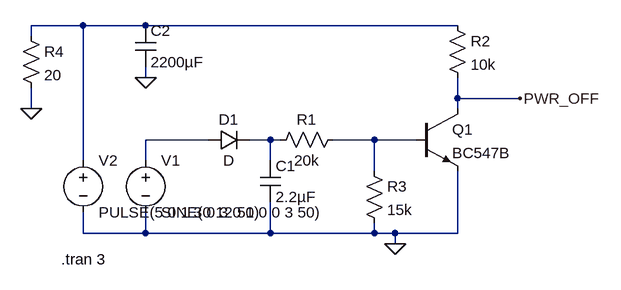
[diagram p0: schematic power-detect-simulation.asc]
power-detect-simulation.asc, the LTspice schematic file:
Version 4
SHEET 1 880 680
WIRE -160 -112 -240 -112
WIRE -64 -112 -160 -112
WIRE 416 -112 -64 -112
WIRE -240 -96 -240 -112
WIRE -64 -32 -64 -48
WIRE 416 0 416 -32
WIRE 512 0 416 0
WIRE -240 16 -240 -16
WIRE 416 16 416 0
WIRE 32 64 -64 64
WIRE 128 64 96 64
WIRE 144 64 128 64
WIRE 288 64 224 64
WIRE 352 64 288 64
WIRE -160 96 -160 -112
WIRE -64 96 -64 64
WIRE 128 96 128 64
WIRE 288 112 288 64
WIRE -160 208 -160 176
WIRE -64 208 -64 176
WIRE -64 208 -160 208
WIRE 128 208 128 160
WIRE 128 208 -64 208
WIRE 288 208 288 192
WIRE 288 208 128 208
WIRE 320 208 288 208
WIRE 416 208 416 112
WIRE 416 208 320 208
WIRE 320 224 320 208
FLAG 320 224 0
FLAG 512 0 PWR_OFF
FLAG -64 -32 0
FLAG -240 16 0
SYMBOL voltage -64 80 R0
WINDOW 123 0 0 Left 0
WINDOW 39 0 0 Left 0
SYMATTR InstName V1
SYMATTR Value SINE(0 12 50 0 0 3 50)
SYMBOL diode 32 80 R270
WINDOW 0 32 32 VTop 2
WINDOW 3 0 32 VBottom 2
SYMATTR InstName D1
SYMBOL res 240 48 R90
WINDOW 0 0 56 VBottom 2
WINDOW 3 32 56 VTop 2
SYMATTR InstName R1
SYMATTR Value 20k
SYMBOL cap 112 96 R0
SYMATTR InstName C1
SYMATTR Value 2.2µF
SYMBOL npn 352 16 R0
SYMATTR InstName Q1
SYMATTR Value BC547B
SYMBOL res 400 -128 R0
SYMATTR InstName R2
SYMATTR Value 10k
SYMBOL voltage -160 80 R0
WINDOW 123 0 0 Left 0
WINDOW 39 0 0 Left 0
SYMATTR InstName V2
SYMATTR Value PULSE(5 0 1 3 0 3 0 1)
SYMBOL res 272 96 R0
SYMATTR InstName R3
SYMATTR Value 15k
SYMBOL cap -80 -112 R0
SYMATTR InstName C2
SYMATTR Value 2200µF
SYMBOL res -256 -112 R0
SYMATTR InstName R4
SYMATTR Value 20
TEXT -194 248 Left 2 !.tran 3

The netlist it stands for:
* power-detect-simulation.asc
V1 N002 0 SINE(0 12 50 0 0 3 50)
D1 N002 N003 D
R1 N004 N003 20k
C1 N003 0 2.2µF
Q1 PWR_OFF N004 0 0 BC547B
R2 N001 PWR_OFF 10k
V2 N001 0 PULSE(5 0 1 3 0 3 0 1)
R3 N004 0 15k
C2 N001 0 2200µF
R4 N001 0 20
.model D D
.lib standard.dio
.model NPN NPN
.model PNP PNP
.lib standard.bjt
.tran 3
.backanno
.end